# Altium schematic sheet 202011AWSNP01.SchDoc
size A4
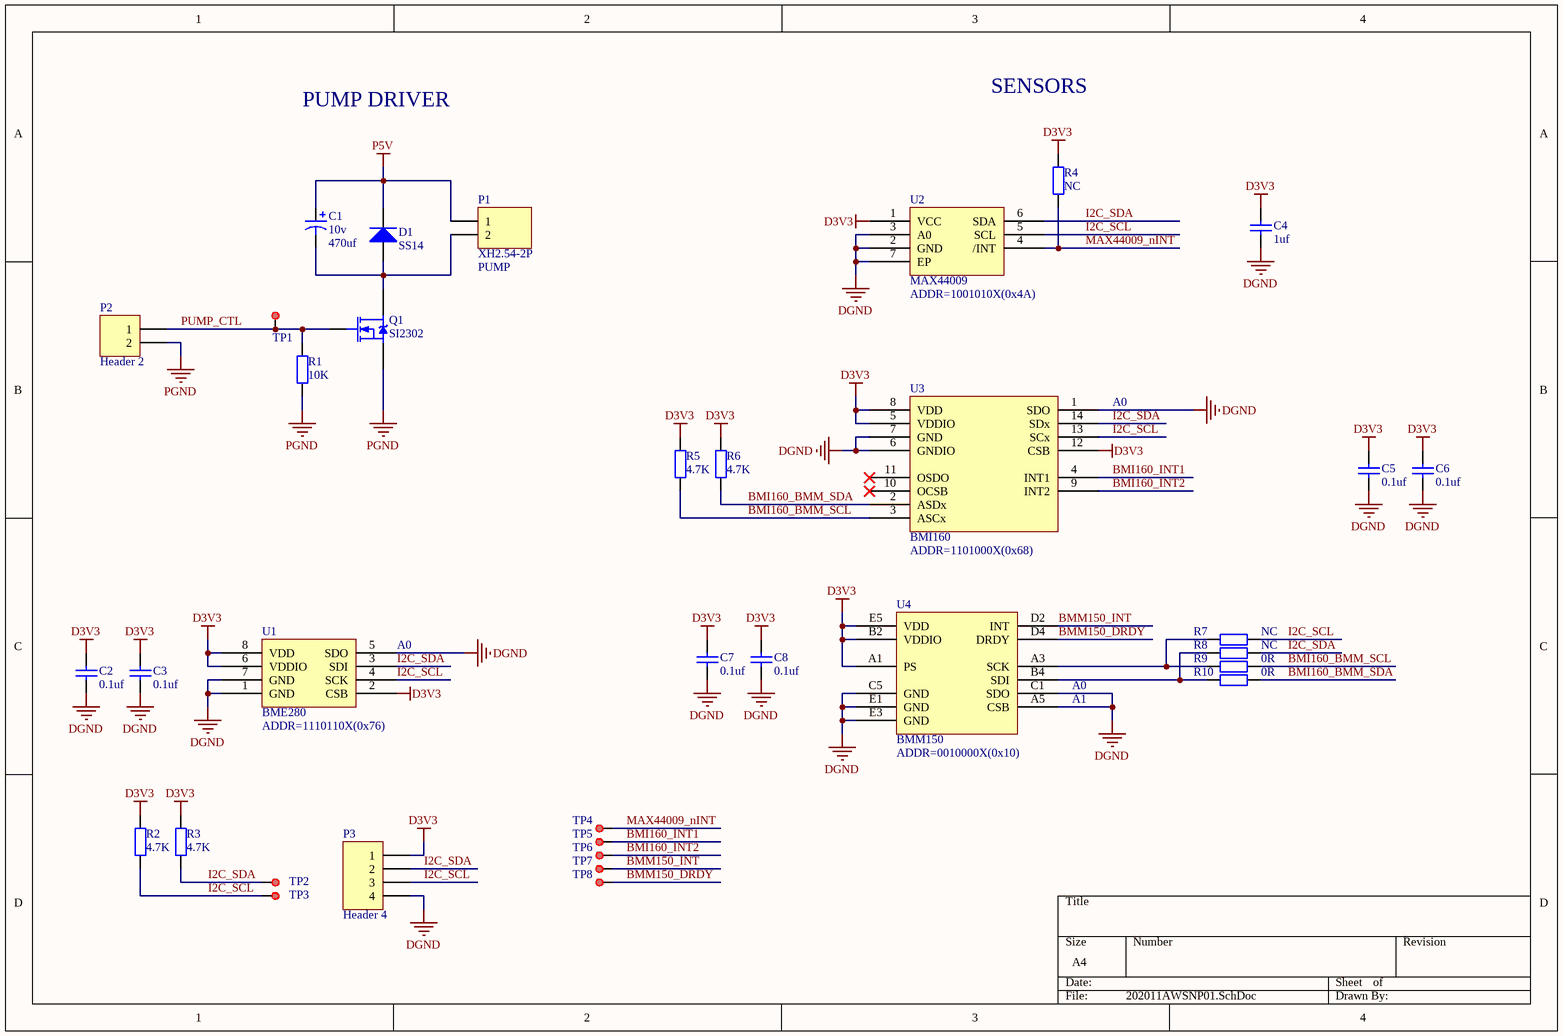
[diagram p0: 202011AWSNP01.SchDoc]

## Parts
C1  value 470uf  voltage: 10v  [C6.3X7.7-SMD]  (hidden comment: Cap2)
C2  value 0.1uf  [C0603]  (hidden comment: Cap)
C3  value 0.1uf  [C0603]  (hidden comment: Cap)
C4  value 1uf  [C0603]  (hidden comment: Cap)
C5  value 0.1uf  [C0603]  (hidden comment: Cap)
C6  value 0.1uf  [C0603]  (hidden comment: Cap)
C7  value 0.1uf  [C0603]  (hidden comment: Cap)
C8  value 0.1uf  [C0603]  (hidden comment: Cap)
D1  value SS14  [SMA/DO-214AC]  (hidden comment: Diode)
P1  XH2.54-2P  [XH2.54-2P]
P2  Header 2  [HDR1X2]
P3  Header 4  [HDR1X4]
Q1  SI2302  [SI2302-SOT23]
R1  value 10K  [R0805]  (hidden comment: Res)
R2  value 4.7K  [R0603]  (hidden comment: Res)
R3  value 4.7K  [R0603]  (hidden comment: Res)
R4  value NC  [R0603]  (hidden comment: Res)
R5  value 4.7K  [R0603]  (hidden comment: Res)
R6  value 4.7K  [R0603]  (hidden comment: Res)
R7  value NC  [R0603]  (hidden comment: Res)
R8  value NC  [R0603]  (hidden comment: Res)
R9  value 0R  [R0603]  (hidden comment: Res)
R10  value 0R  [R0603]  (hidden comment: Res)
TP1  TestPoint  [TestPoint-R30]  (value not drawn)
TP2  TestPoint  [TestPoint-R30]  (value not drawn)
TP3  TestPoint  [TestPoint-R30]  (value not drawn)
TP4  TestPoint  [TestPoint-R30]  (value not drawn)
TP5  TestPoint  [TestPoint-R30]  (value not drawn)
TP6  TestPoint  [TestPoint-R30]  (value not drawn)
TP7  TestPoint  [TestPoint-R30]  (value not drawn)
TP8  TestPoint  [TestPoint-R30]  (value not drawn)
U1  BME280  [BME280-LGA8]
U2  MAX44009  [MAX44009-UTDFN6]
U3  BMI160  [BMI160-LGA14]
U4  BMM150  [BMM150-BGA12+]

## Nets
D3V3: C2.2 C3.2 C4.1 C5.2 C6.2 C7.2 C8.2 P3.1 R2.2 R3.2 R4.2 R5.2 R6.2 U1.2(CSB) U1.6(VDDIO) U1.8(VDD) U2.1(VCC) U3.5(VDDIO) U3.8(VDD) U3.12(CSB) U4.A1(PS) U4.B2(VDDIO) U4.E5(VDD)
DGND: C2.1 C3.1 C4.2 C5.1 C6.1 C7.1 C8.1 P3.4 U1.1(GND) U1.5(SDO) U1.7(GND) U2.2(GND) U2.3(A0) U2.7(EP) U3.1(SDO) U3.6(GNDIO) U3.7(GND) U4.A5(CSB) U4.C1(SDO) U4.C5(GND) U4.E1(GND) U4.E3(GND)
P5V: C1.1 D1.2(K) P1.1
PGND: P2.2 Q1.2(S) R1.1
BMI160_BMM_SCL: R5.1 R9.1 U3.3(ASCx)
BMI160_BMM_SDA: R6.1 R10.1 U3.2(ASDx)
BMI160_INT1: TP5.1 U3.4(INT1)
BMI160_INT2: TP6.1 U3.9(INT2)
BMM150_DRDY: TP8.1 U4.D4(DRDY)
BMM150_INT: TP7.1 U4.D2(INT)
I2C_SCL: P3.3 R2.1 R7.1 TP3.1 U1.4(SCK) U2.5(SCL) U3.13(SCx)
I2C_SDA: P3.2 R3.1 R8.1 TP2.1 U1.3(SDI) U2.6(SDA) U3.14(SDx)
MAX44009_nINT: R4.1 TP4.1 U2.4(/INT)
PUMP_CTL: P2.1 Q1.1(G) R1.2 TP1.1
NetC1_2: C1.2 D1.1(A) P1.2 Q1.3(D)
NetR7_2: R7.2 R9.2 U4.A3(SCK)
NetR8_2: R8.2 R10.2 U4.B4(SDI)

Not connected (* = marked no-connect by the designer): U3 10(OCSB)* 11(OSDO)*

## Notes on the sheet
- PUMP DRIVER
- SENSORS
- (near P1) PUMP
- (near U2) ADDR=1001010X(0x4A)
- A0
- (near U3) ADDR=1101000X(0x68)
- (near U1) A0
- A1
- (near U1) ADDR=1110110X(0x76)
- (near U4) ADDR=0010000X(0x10)

## Library data of the parts
P2 = Header 2: Header, 2-Pin; LatestRevisionDate: 17-Jul-2002; LatestRevisionNote: Re-released for DXP Platform.; Publisher: Altium Limited
P3 = Header 4: Header, 4-Pin; LatestRevisionDate: 17-Jul-2002; LatestRevisionNote: Re-released for DXP Platform.; Publisher: Altium Limited
Q1 = SI2302: N-Channel 20 V (D-S) MOSFET
R1-R10 = Res: 电阻
TP1-TP8 = TestPoint: 测试点
U1 = BME280: Combined humidity and pressure sensor
U2 = MAX44009: Industry’s Lowest-Power Ambient Light Sensor with ADC
U3 = BMI160: Small, low-power Inertial Measurement Unit
U4 = BMM150: THREE-AXIS GEOMAGNETIC SENSOR